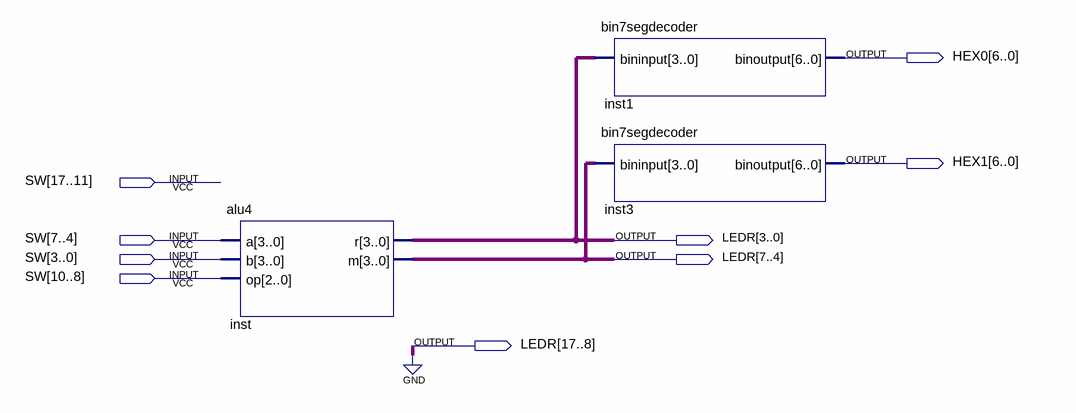
[diagram p0: schematic sheet]
// Quartus schematic ALUDemo.bdf as structural Verilog: 3 symbols, 9 pins
module ALUDemo (
  input  [17:0] SW,
  output [6:0] HEX0,
  output [6:0] HEX1,
  output [17:0] LEDR
);

  alu4 inst (.a(SW[7:4]), .b(SW[3:0]), .op(SW[10:8]), .r(LEDR[3:0]), .m(LEDR[7:4]));
  bin7segdecoder inst1 (.bininput(LEDR[3:0]), .binoutput(HEX0));
  bin7segdecoder inst3 (.bininput(LEDR[7:4]), .binoutput(HEX1));

  assign LEDR[17:8] = {10{1'b0}};
endmodule
